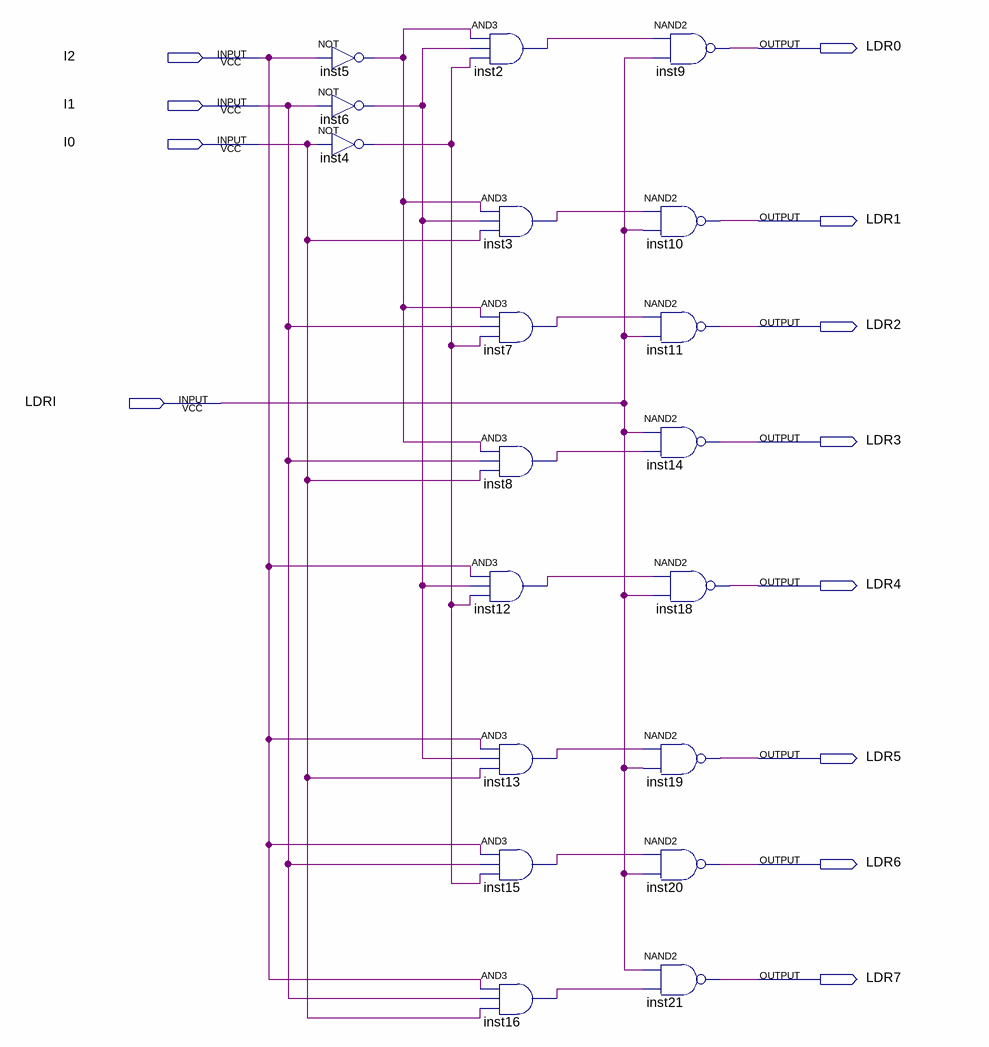
[diagram p0: schematic sheet]
// Quartus schematic ldr0_2.bdf as structural Verilog: 19 symbols, 12 pins
module ldr0_2 (
  input  I2,
  input  I1,
  input  I0,
  input  LDRI,
  output LDR0,
  output LDR1,
  output LDR2,
  output LDR3,
  output LDR4,
  output LDR5,
  output LDR6,
  output LDR7
);

  wire inst2_out, inst3_out, inst4_out, inst5_out, inst6_out, inst7_out, inst8_out, inst12_out, inst13_out,
       inst15_out, inst16_out;

  not inst5 (inst5_out, I2);
  not inst6 (inst6_out, I1);
  not inst4 (inst4_out, I0);
  and inst2 (inst2_out, inst5_out, inst6_out, inst4_out);
  and inst3 (inst3_out, inst5_out, inst6_out, I0);
  and inst7 (inst7_out, inst5_out, I1, inst4_out);
  and inst8 (inst8_out, inst5_out, I1, I0);
  and inst12 (inst12_out, I2, inst6_out, inst4_out);
  and inst13 (inst13_out, I2, inst6_out, I0);
  and inst15 (inst15_out, I2, I1, inst4_out);
  and inst16 (inst16_out, I2, I1, I0);
  nand inst9 (LDR0, inst2_out, LDRI);
  nand inst10 (LDR1, inst3_out, LDRI);
  nand inst11 (LDR2, inst7_out, LDRI);
  nand inst14 (LDR3, LDRI, inst8_out);
  nand inst18 (LDR4, inst12_out, LDRI);
  nand inst19 (LDR5, inst13_out, LDRI);
  nand inst20 (LDR6, inst15_out, LDRI);
  nand inst21 (LDR7, LDRI, inst16_out);
endmodule
